# Altium schematic sheet Power.SchDoc
size A4; SheetNumber: 2; SheetTotal: 6
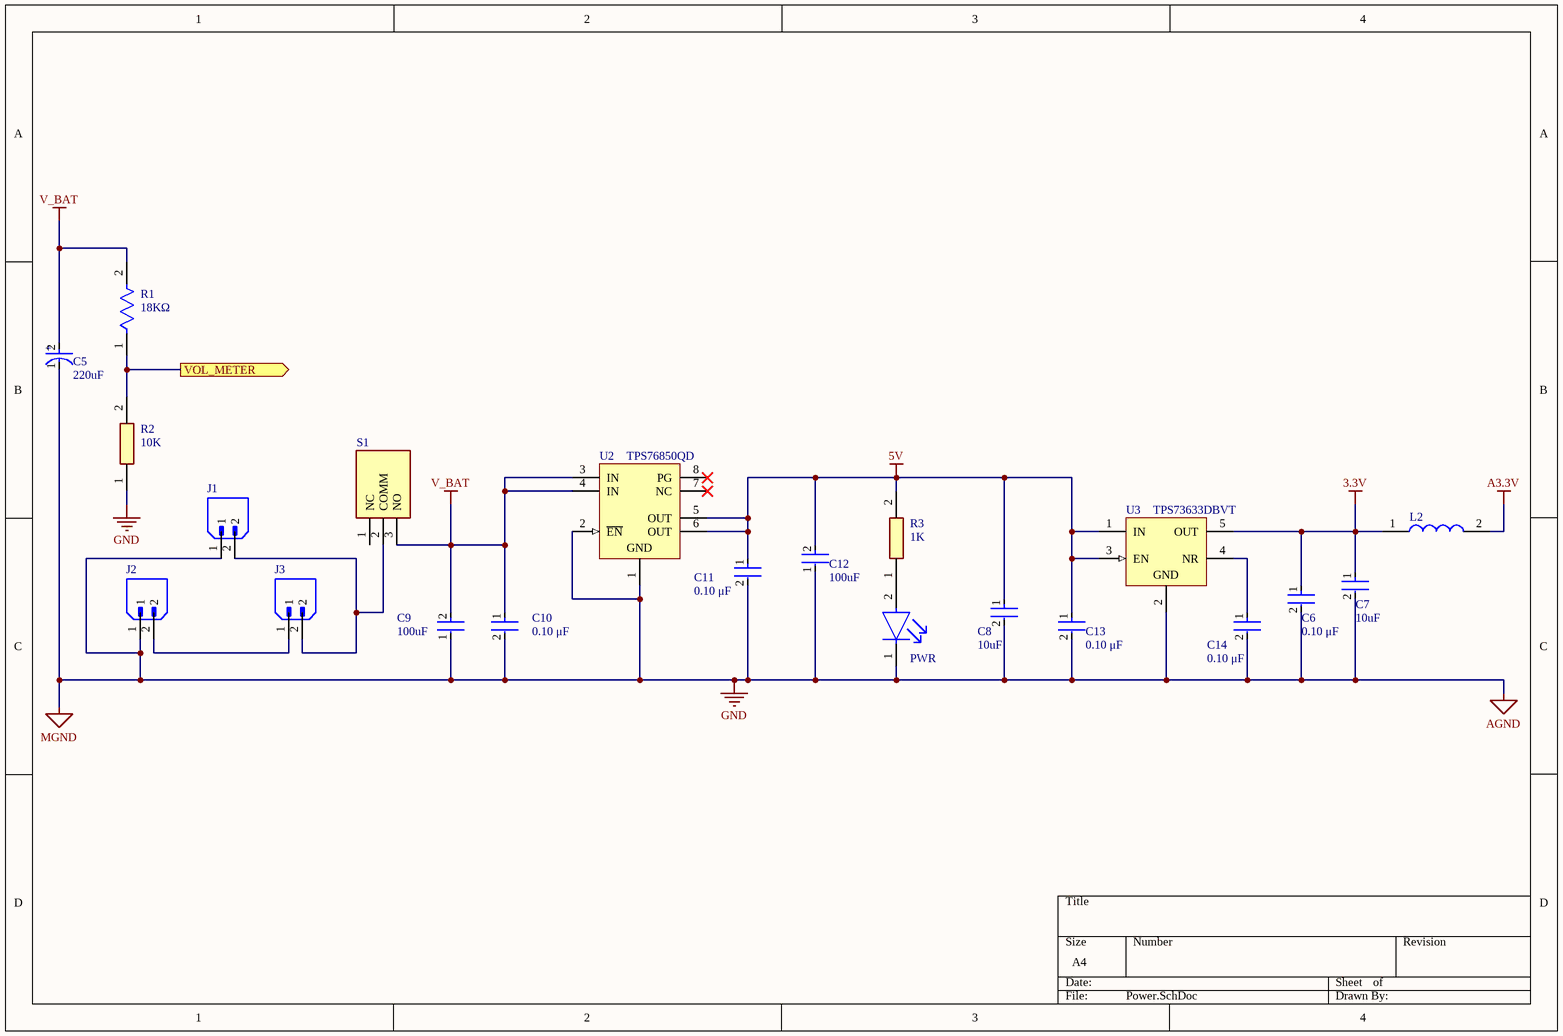
[diagram p0: Power.SchDoc]

## Parts
C5  Capacitance: 220uF  [FP-FTF-MFG]  (hidden comment: EEEFT1H221AP)
C6  value 0.10 μF  [FP-C1206C-EB-MFG]  (hidden comment: C1206C104K1RACTU)
C7  Capacitance: 10uF  [FP-GRM21B-0_1-IPC_C]  (hidden comment: GRM21BR61C106KE15L)
C8  Capacitance: 10uF  [FP-GRM21B-0_1-IPC_C]  (hidden comment: GRM21BR61C106KE15L)
C9  value 100uF  [FP-EMK325A-M-MFG]  (hidden comment: EMK325ABJ107MM-T)
C10  value 0.10 μF  [FP-C1206C-EB-MFG]  (hidden comment: C1206C104K1RACTU)
C11  value 0.10 μF  [FP-C1206C-EB-MFG]  (hidden comment: C1206C104K1RACTU)
C12  value 100uF  [FP-EMK325A-M-MFG]  (hidden comment: EMK325ABJ107MM-T)
C13  value 0.10 μF  [FP-C1206C-EB-MFG]  (hidden comment: C1206C104K1RACTU)
C14  value 0.10 μF  [FP-C1206C-EB-MFG]  (hidden comment: C1206C104K1RACTU)
J1  B2B-XH-A(LF)(SN)  [JST_B2B-XH-A(LF)(SN)]  (value not drawn)
J2  B2B-XH-A(LF)(SN)  [JST_B2B-XH-A(LF)(SN)]  (value not drawn)
J3  B2B-XH-A(LF)(SN)  [JST_B2B-XH-A(LF)(SN)]  (value not drawn)
L2  LBR2012T100K  [INDC2012X145N]  (value not drawn)
PWR  HSMS-C150  [FP-HSMS-C150-MFG]  (value not drawn)
R1  value 18KΩ  [FP-CRGCQ2010-IPC_C]  (hidden comment: CRGCQ2010F18K)
R2  value 10K  [ERJP06D1000V]  (hidden comment: ERJ-P06D1002V)
R3  value 1K  [RESC2013X65N]  (hidden comment: 0805W8F1001T5E)
S1  EG1218  [EG1218]  (value not drawn)
U2  TPS76850QD  [D0008A_L]
U3  TPS73633DBVT  [DBV0005A_M]

## Ports
VOL_METER (out)

## Nets
3.3V: C6.1 C7.1 L2.1 U3.5(OUT)
5V: C8.1 C11.1 C12.2 C13.1 R3.2 U2.5(OUT) U2.6(OUT) U3.1(IN) U3.3(EN)
A3.3V: L2.2
AGND: C5.1(C) C6.2 C7.2 C8.2 C9.1 C10.2 C11.2 C12.1 C13.2 C14.2 J1.1 J2.1 PWR.1(C) R2.1 U2.1(GND) U2.2(~{EN}) U3.2(GND)  [also labelled GND, MGND]
V_BAT: C5.2(A) C9.2 C10.1 R1.2 S1.3(NO) U2.3(IN) U2.4(IN)
VOL_METER: R1.1 R2.2 ; port VOL_METER
NetC14_1: C14.1 U3.4(NR)
NetJ1_2: J1.2 J3.2 S1.2(COMM)
NetJ2_2: J2.2 J3.1
NetPWR_2: PWR.2(A) R3.1

Not connected (* = marked no-connect by the designer): S1 1(NC); U2 7(NC)* 8(PG)*

## Notes on the sheet
- (in symbol CMP-05427-000092-1) +

## Library data of the parts
C5 = CMP-05427-000092-1: CAP ALUM 220UF 20% 50V SMD; Ripple Current (AC): 670mA; Dielectric Material: Aluminium; Life (Hours): 2000Hour; Leakage Current: 110uA; Lead Diameter: 0.9mm; ESR (Equivalent Series Resistance): 180mR; REACH SVHC: No SVHC; Voltage Rating (DC): 50V; Radiation Hardening: No; Length: 10.2mm; Construction: Cylindrical; Case/Package: Radial; Series: FT; Lead Free: Lead Free; Voltage Rating: 50V; Tolerance: 20%; Contact Plating: Tin; Number of Pins: 2; Height - Seated (Max): 0.413inch; RoHS Compliant: Yes; Diameter: 8mm; Ripple Current: 670mA; Lead Pitch: 3.1mm; Termination: SMD/SMT; Mount: Surface Mount; Min Operating Temperature: -55°C; Max Operating Temperature: 105°C; Voltage: 50V; Height: 10.2mm; Package Quantity: 500; Packaging: Tape and Reel
C6 C10 C11 C13 C14 = CMP-03020-000153-1: CAP CER 0.1UF 100V X7R 1206; Manufacturer: KEMET; Tolerance: 0.1; Material: Ceramic; Temperature Coefficient: 15%; Automotive Grade: Grade 0; Voltage Rating: 100 V; Automotive: Yes; Ipc Land Pattern Name: CAPC320160X78; Device Class L1: Passive Components; ComponentLink2Description: Datasheet; Temperature Range Low: -55°C; Category: Cap; Octopart: https://octopart.com/c1206c104k1ractu-kemet-89521; Height: 0.88mm; Lead Free: Yes; Digikey Description: CAP CER 0.1UF 100V X7R 1206; Mouser Description: CAP CER 0.1UF 100V X7R 1206; Device Class L3: Ceramic Capacitors; Device Class L2: Capacitors; ComponentLink2URL: https://content.kemet.com/datasheets/KEM_C1007_X8R_ULTRA_150C_SMD.pdf; Temperature Range High: +150°C; Temperature Characteristic: X7R; Manufacturer Part Number: C1206C104K1RACTU; RoHS: TRUE; Capacitance: 0.10 μF; Package: C1206C-EB; Temperature: -55°C to +150°C
C7 C8 = CMP-2007-03453-2: Chip Multilayer Ceramic Capacitors for General Purpose, 0805, 10uF, X5R, 15%, 10%, 16V; Radiation Hardening: No; Thickness: 0.053inch; Voltage Rating (DC): 16V; Lead Free: Lead Free; Package Quantity: 1; Width: 1.25mm; Case Code (Imperial): 0805; Depth: 1.25mm; Packaging: Tape and Reel; Dielectric: X5R; Max Operating Temperature: 85°C; Tolerance: 10%; Voltage Rating: 16V; Voltage: 16V; Height: 1.25mm; Case Code (Metric): 2012; Material: Ceramic; Mount: Surface Mount; Case/Package: 0805; REACH SVHC: No SVHC; Length: 2mm; Min Operating Temperature: -55°C; Termination: SMD/SMT
C9 C12 = CMP-2000-05020-2: CAP CER 100UF 16V X5R 1210; Manufacturer: Taiyo Yuden; Material: Ceramic; Temperature Coefficient: 15%; Tolerance: 20%; Ipc Land Pattern Name: CAPC320250X250; Package: EMK325A-M; Device Class L1: Passive Components; Height: 2.8mm; Device Class L2: Capacitors; Temperature Range Low: -55°C; RoHS: TRUE; Temperature Characteristic: X5R; Mouser Description: 1210 100 uF 16 V ±20% Tolerance X5R SMT Multilayer Ceramic Capacitor; ComponentLink2Description: Datasheet; Temperature: -55°C to +85°C; Device Class L3: Ceramic Capacitors; Capacitance: 100uF; Lead Free: Yes; Category: Cap; Octopart: https://octopart.com/emk325abj107mm-t-taiyo+yuden-20815747; Temperature Range High: +85°C; Automotive: No; Manufacturer Part Number: EMK325ABJ107MM-T; Digikey Description: CAP CER 100UF 16V X5R 1210; Voltage Rating: 16V; ComponentLink2URL: https://www.yuden.co.jp/productdata/catalog/mlcc01_e.pdf
J1-J3 = B2B-XH-A(LF)(SN): Connector Header Through Hole 2 position 0.098 (2.50mm); MF: JST Sales America Inc.; SnapEDA_Link: https://www.snapeda.com/parts/B2B-XH-A(LF)(SN)/JST+Sales+America+Inc./view-part/?ref=snap; Package: None; Value: *; MP: B2B-XH-A(LF)(SN); Check_prices: https://www.snapeda.com/parts/B2B-XH-A(LF)(SN)/JST+Sales+America+Inc./view-part/?ref=eda
L2 = LBR2012T100K: Inductor; Manufacturer_Name: TAIYO YUDEN; Datasheet Link: https://componentsearchengine.com/Datasheets/2/LBR2012T100K.pdf; Height: 1.45mm; Manufacturer_Part_Number: LBR2012T100K; Mouser Part Number: 963-LBR2012T100K; Mouser Price/Stock: https://www.mouser.co.uk/ProductDetail/TAIYO-YUDEN/LBR2012T100K?qs=PzICbMaShUet3AhlAozLXg%3D%3D; Arrow Part Number: LBR2012T100K; Arrow Price/Stock: https://www.arrow.com/en/products/lbr2012t100k/taiyo-yuden
PWR = CMP-21615-000001-1: LED RED DIFFUSED CHIP SMD; Luminous Intensity: 10mcd; Power Dissipation: 65mW; Viewing Angle: 170°; Number of Elements: 1; Forward Current: 20mA; Lens Color: White; Lens Style: Rectangular; Wavelength: 626nm; Forward Voltage: 2.1V; Reverse Voltage: 5V; Number of Pins: 2; Color: Red; Lead Free: Lead Free; Width: 1.6mm; Length: 3.2mm; REACH SVHC: No SVHC; Height: 1.1mm; Depth: 1.6mm; Power Rating: 65mW; Package Quantity: 1; Illumination Color: Red; Radiation Hardening: No; Case Code (Imperial): 1206; Max Operating Temperature: 85°C; Test Current: 20mA; Case/Package: 1206; Lens Transparency: Diffused; Number of LEDs: 1; Packaging: Tape and Reel; Mount: Surface Mount; Min Operating Temperature: -40°C; Case Code (Metric): 3216; Dominant Wavelength: 626nm
R1 = CMP-03211-008837-1: CRGCQ2010 18KΩ 0.75W ±100ppm/°C 1% 200V; Manufacturer: TE Connectivity; Automotive Grade: Grade 0; Tolerance: 0.01; Automotive: Yes; Height: 0.65mm; Lead Free: Yes; Series: CRGCQ; Temperature: -55°C to +155°C; Temperature Range Low: -55°C; Composition: Thick Film; Ipc Land Pattern Name: RESC500250X55; Category: Res; Manufacturer Part Number: CRGCQ2010F18K; ComponentLink2Description: Datasheet; Voltage Rating: 200V; RoHS: TRUE; ComponentLink2URL: https://www.te.com/commerce/DocumentDelivery/DDEController?Action=showdoc&DocId=Data+Sheet%7F1773204-3%7F1%7Fpdf%7FEnglish%7FENG_DS_1773204-3_1.pdf%7F4-2176347-976; Power Rating: 0.75W; Device Class L1: Passive Components; Package: CRGCQ2010; Temperature Range High: +155°C; Octopart: https://octopart.com/crgcq2010f18k-te+connectivity-91018464; Device Class L2: Resistors; Device Class L3: Chip SMD Resistors; Ambient Temperature Range High: +70°C; Temperature Coefficient: ±100ppm/°C; Resistance: 18KΩ
R2 = ERJ-P06D1002V: Resistor; Manufacturer_Name: Panasonic; Datasheet Link: http://industrial.panasonic.com/cdbs/www-data/pdf/RDA0000/AOA0000C102.pdf; Height: 0.7mm; Manufacturer_Part_Number: ERJ-P06D1002V; Arrow Part Number: ERJ-P06D1002V; Arrow Price/Stock: https://www.arrow.com/en/products/erj-p06d1002v/panasonic
R3 = 0805W8F1001T5E: Resistor; Manufacturer_Name: ROYALOHM; Datasheet Link: https://www.mouser.de/datasheet/2/1365/1-3044649.pdf; Height: 0.65mm; Manufacturer_Part_Number: 0805W8F1001T5E; Mouser Part Number: 303-0805W8F1001T5E; Mouser Price/Stock: https://www.mouser.co.uk/ProductDetail/Royalohm/0805W8F1001T5E?qs=e8oIoAS2J1RgTTQhbYTt7g%3D%3D
S1 = EG1218: Switch; Manufacturer_Name: E-Switch; Datasheet Link: https://configured-product-images.s3.amazonaws.com/2D/specs/EG1218.pdf; Height: 7.4mm; Manufacturer_Part_Number: EG1218; Mouser Part Number: 612-EG1218; Mouser Price/Stock: https://www.mouser.co.uk/ProductDetail/E-Switch/EG1218?qs=xDsBkp9LkocT0c8K%252B5e%2FgA%3D%3D
U2 = CMP-0395-00120-2: Single Output Fast Transient Response LDO, 1 A, Fixed 5 V Output, 2.7 to 10 V Input, with Low IQ, 8-pin SOIC (D), -40 to 125 degC, Green (RoHS & no Sb/Br); Manufacturer: Texas Instruments; Iq(Typ)(mA): 0.08; Vin(Min)(V): 2.7; Fixed Output Options(V): 5; SubFamily: Single Channel LDO; Iout(Max)(A): 1; Power Good: TRUE; Accuracy(%): 2; Vin(Max)(V): 10; Vdo(Typ)(mV): 230; PartNumber: TPS76850QD; Code_JEDEC: MS-012; ComponentLink2URL: http://www.ti.com/general/docs/lit/getliterature.tsp?genericPartNumber=TPS76850&fileType=pdf; Vout Adj(Min)(V): 5; PackageReference: D0008A; Vout Adj(Max)(V): 5; PackageVersion: 4040047-3/M; ComponentLink3URL: http://www.ti.com/litv/pdf/msoi002j; DatasheetVersion: SLVS211L; PackageDescription: 8-Pin Plastic Small Outline, Body 4.9 x 3.9 mm, Pitch 1.27 mm; ComponentLink1Description: Manufacturer URL; Mounting Technology: Surface Mount; ComponentLink1URL: http://www.ti.com/; Eco-Plan: Green (RoHS & no Sb/Br); ComponentLink2Description: Datasheet; ComponentLink3Description: Package Specification
U3 = CMP-0395-00251-2: Single Output Low Noise LDO, 400 mA, Fixed 3.3 V Output, 1.7 to 5.5 V Input, with Reverse Current Protection, 5-pin SOT-23 (DBV), -40 to 85 degC, Green (RoHS & no Sb/Br); Manufacturer: Texas Instruments; Vin(Min)(V): 1.7; Vin(Max)(V): 5.5; Vout Adj(Min)(V): 3.3; Accuracy(%): 1; SubFamily: Single Channel LDO; Rating: Catalog; Iout(Max)(A): 0.4; Iq(Typ)(mA): 0.3; Vdo(Typ)(mV): 75; ComponentLink1URL: http://www.ti.com/; ComponentLink4URL: Samples URL:http://www.ti.com/product/tps73633#samples; ComponentLink2Description: Datasheet; ComponentLink3URL: http://www.ti.com/litv/pdf/mpds018i; Code_JEDEC: MO-178; ComponentLink4Description: URL Link1; Eco-Plan: Green (RoHS & no Sb/Br); PartNumber: TPS73633DBVT; PackageVersion: 4073253-4/K; ComponentLink2URL: http://www.ti.com/general/docs/lit/getliterature.tsp?genericPartNumber=TPS73633&fileType=pdf; Fixed Output Options(V): 3.3; Mounting Technology: Surface Mount; PackageDescription: 5-Pin Plastic Small Outline, Body 1.60 Ãƒâ€” 2.90 mm, Pitch 0.95 mm; DatasheetVersion: SBVS038T; Vout Adj(Max)(V): 3.3; ComponentLink1Description: Manufacturer URL; ComponentLink3Description: Package Specification; PackageReference: DBV0005A